# Altium schematic sheet MembraneSensor.SchDoc
size A4; SheetNumber: 6; SheetTotal: 8
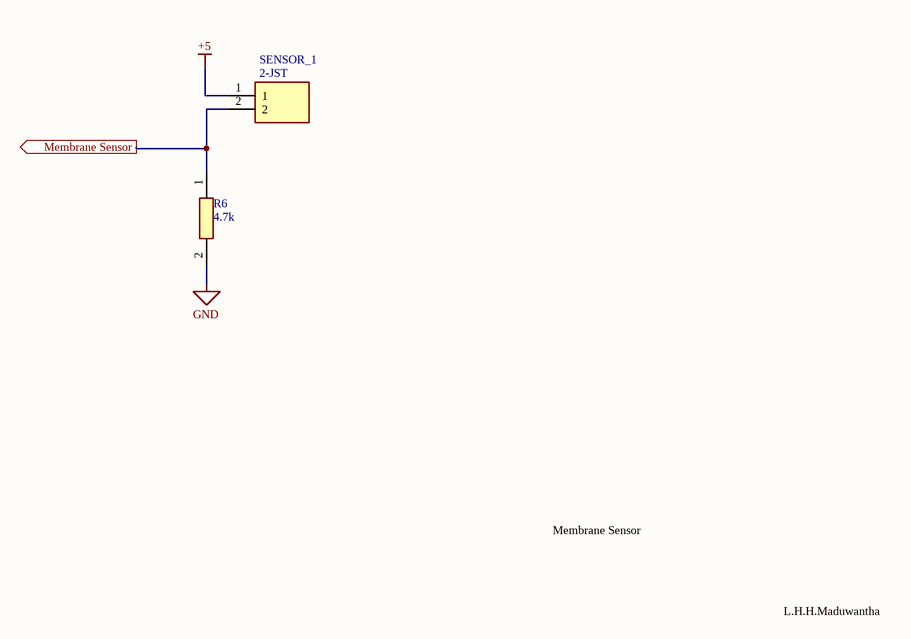
[diagram p0: MembraneSensor.SchDoc]

## Parts
R6  Resistance: 4.7k  [RESC1005X40N]  (hidden comment: RC0402FR-074K7L)
SENSOR_1  Name: 2-JST  [B2BXHAMLFSN]  (hidden comment: B2B-XH-AM_LF__SN_)

## Ports
Membrane Sensor (out, see Main[1B], MCU[3B])

## Nets
+5: SENSOR_1.1
GND: R6.2
Membrane Sensor: R6.1 SENSOR_1.2 ; port Membrane Sensor

## Notes on the sheet
- Membrane Sensor
- L.H.H.Maduwantha

## Library data of the parts
R6 = RC0402FR-074K7L: Resistor; Manufacturer_Name: KEMET; Datasheet Link: http://www.yageo.com/documents/recent/PYu-RC0402_51_RoHS_L_6_r.pdf; Height: 0.4mm; Manufacturer_Part_Number: RC0402FR-074K7L; Mouser Part Number: 603-RC0402FR-074K7L; Mouser Price/Stock: https://www.mouser.co.uk/ProductDetail/YAGEO/RC0402FR-074K7L?qs=V1yeUXFNrkn%2FmCXC8N8TTA%3D%3D; Arrow Part Number: RC0402FR-074K7L; Arrow Price/Stock: https://www.arrow.com/en/products/rc0402fr-074k7l/yageo
SENSOR_1 = B2B-XH-AM_LF__SN_: Connector; Manufacturer_Name: JST (JAPAN SOLDERLESS TERMINALS); Manufacturer_Part_Number: B2B-XH-AM(LF)(SN); Datasheet Link: https://www.jst-mfg.com/product/pdf/eng/eXH.pdf; Height: 7mm; Arrow Part Number: B2B-XH-AM(LF)(SN); Arrow Price/Stock: https://www.arrow.com/en/products/b2b-xh-am-lf-sn/jst-manufacturing?region=europe